# EAGLE design eightbyeight-testcard (EAGLE 7.5.0)

## Sheet 1 of 2
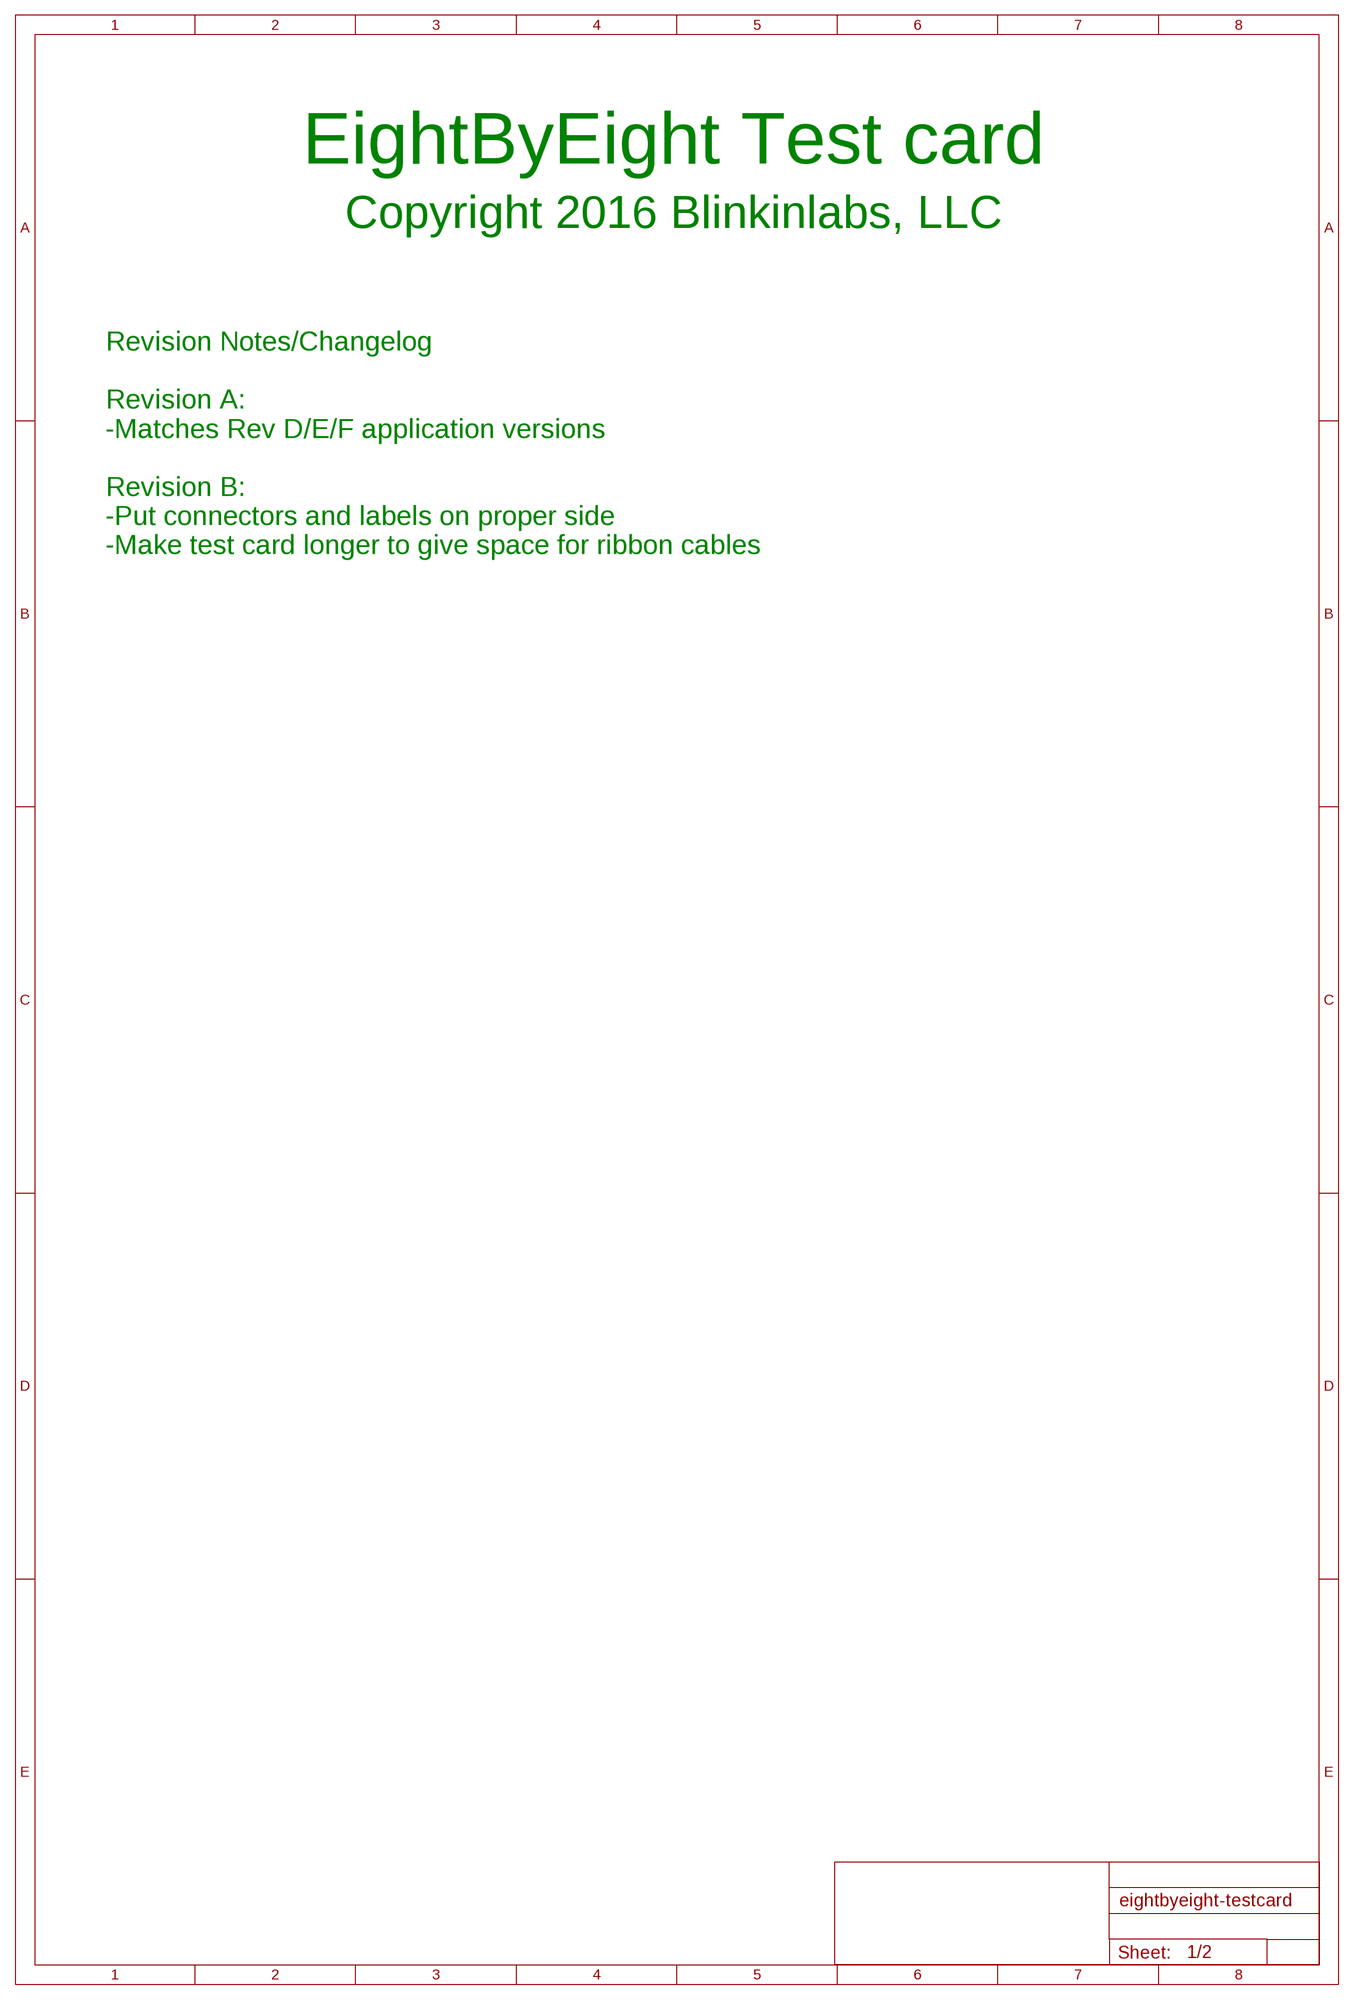
[diagram p0: schematic, sheet 1]

### Notes on the sheet
- EightByEight Test card
- Copyright 2016 Blinkinlabs, LLC
- Revision Notes/Changelog
  
  Revision A:
  -Matches Rev D/E/F application versions
  
  Revision B:
  -Put connectors and labels on proper side
  -Make test card longer to give space for ribbon cables

## Sheet 2 of 2
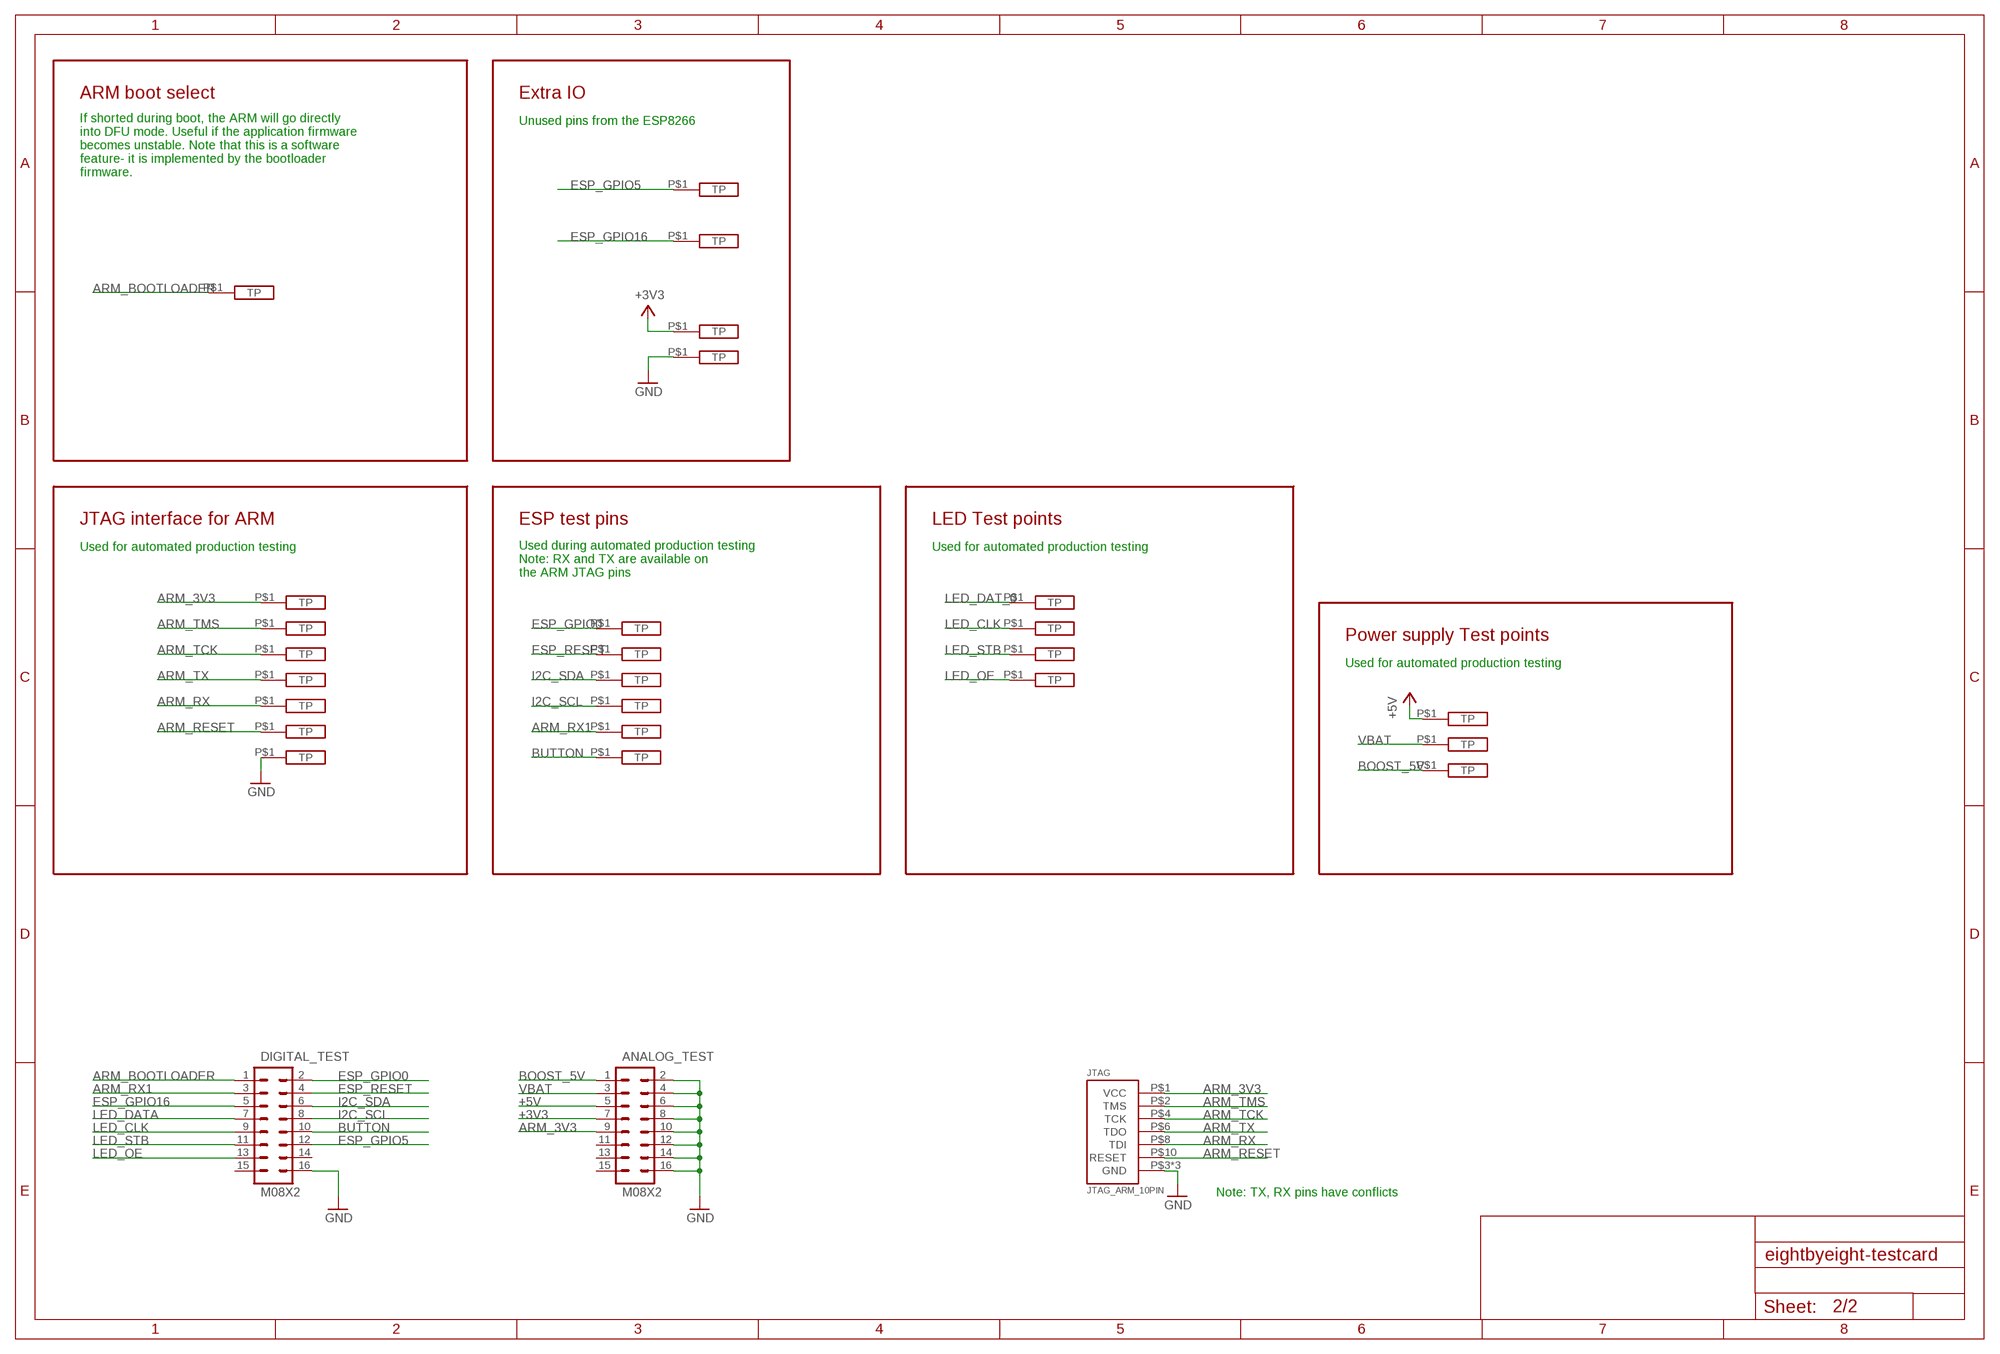
[diagram p1: schematic, sheet 2]

### Parts
5V  TEST_POINT1.4MM  [IO_HOLE_1.4MM]
+3V3  TEST_POINT2.55MM  [IO_HOLE_2.55MM]
ANALOG_TEST  M08X2  [2X8]
ARM_3V3  TEST_POINT1.4MM  [IO_HOLE_1.4MM]
ARM_BOOT  TEST_POINT1.4MM  [IO_HOLE_1.4MM]
ARM_RESET  TEST_POINT1.4MM  [IO_HOLE_1.4MM]
ARM_RX  TEST_POINT1.4MM  [IO_HOLE_1.4MM]
ARM_RX1  TEST_POINT1.4MM  [IO_HOLE_1.4MM]
ARM_TCK  TEST_POINT1.4MM  [IO_HOLE_1.4MM]
ARM_TMS  TEST_POINT1.4MM  [IO_HOLE_1.4MM]
ARM_TX  TEST_POINT1.4MM  [IO_HOLE_1.4MM]
BOOST_5V  TEST_POINT1.4MM  [IO_HOLE_1.4MM]
BUTTON  TEST_POINT1.4MM  [IO_HOLE_1.4MM]
DIGITAL_TEST  M08X2  [2X8]
ESP_GPIO0  TEST_POINT1.4MM  [IO_HOLE_1.4MM]
ESP_GPIO5  TEST_POINT2.55MM  [IO_HOLE_2.55MM]
ESP_GPIO16  TEST_POINT2.55MM  [IO_HOLE_2.55MM]
ESP_RESET  TEST_POINT1.4MM  [IO_HOLE_1.4MM]
GND  TEST_POINT2.55MM  [IO_HOLE_2.55MM]
GND_  TEST_POINT1.4MM  [IO_HOLE_1.4MM]
I2C_SCL  TEST_POINT1.4MM  [IO_HOLE_1.4MM]
I2C_SDA  TEST_POINT1.4MM  [IO_HOLE_1.4MM]
JTAG  JTAG_ARM_10PIN  [2X05-1.27MM-SMD]
LED_CLK  TEST_POINT1.4MM  [IO_HOLE_1.4MM]
LED_DATA  TEST_POINT1.4MM  [IO_HOLE_1.4MM]
LED_OE  TEST_POINT1.4MM  [IO_HOLE_1.4MM]
LED_STB  TEST_POINT1.4MM  [IO_HOLE_1.4MM]
VBAT  TEST_POINT1.4MM  [IO_HOLE_1.4MM]

### Nets
+3V3: +3V3.P$1(TP) ANALOG_TEST.7
+5V: 5V.P$1(TP) ANALOG_TEST.5
ARM_3V3: ANALOG_TEST.9 ARM_3V3.P$1(TP) JTAG.P$1(VCC)
ARM_BOOTLOADER: ARM_BOOT.P$1(TP) DIGITAL_TEST.1
ARM_RESET: ARM_RESET.P$1(TP) JTAG.P$10(RESET)
ARM_RX: ARM_RX.P$1(TP) JTAG.P$8(TDI)
ARM_RX1: ARM_RX1.P$1(TP) DIGITAL_TEST.3
ARM_TCK: ARM_TCK.P$1(TP) JTAG.P$4(TCK)
ARM_TMS: ARM_TMS.P$1(TP) JTAG.P$2(TMS)
ARM_TX: ARM_TX.P$1(TP) JTAG.P$6(TDO)
BOOST_5V: ANALOG_TEST.1 BOOST_5V.P$1(TP)
BUTTON: BUTTON.P$1(TP) DIGITAL_TEST.10
ESP_GPIO0: DIGITAL_TEST.2 ESP_GPIO0.P$1(TP)
ESP_GPIO5: DIGITAL_TEST.12 ESP_GPIO5.P$1(TP)
ESP_GPIO16: DIGITAL_TEST.5 ESP_GPIO16.P$1(TP)
ESP_RESET: DIGITAL_TEST.4 ESP_RESET.P$1(TP)
GND: ANALOG_TEST.2 ANALOG_TEST.4 ANALOG_TEST.6 ANALOG_TEST.8 ANALOG_TEST.10 ANALOG_TEST.12 ANALOG_TEST.14 ANALOG_TEST.16 DIGITAL_TEST.16 GND.P$1(TP) GND_.P$1(TP) JTAG.P$3(GND) JTAG.P$5(GND) JTAG.P$9(GND)
I2C_SCL: DIGITAL_TEST.8 I2C_SCL.P$1(TP)
I2C_SDA: DIGITAL_TEST.6 I2C_SDA.P$1(TP)
LED_CLK: DIGITAL_TEST.9 LED_CLK.P$1(TP)
LED_DAT_0: LED_DATA.P$1(TP)
LED_DATA: DIGITAL_TEST.7
LED_OE: DIGITAL_TEST.13 LED_OE.P$1(TP)
LED_STB: DIGITAL_TEST.11 LED_STB.P$1(TP)
VBAT: ANALOG_TEST.3 VBAT.P$1(TP)
Unconnected: ANALOG_TEST.11 ANALOG_TEST.13 ANALOG_TEST.15 DIGITAL_TEST.14 DIGITAL_TEST.15

### Notes on the sheet
- ARM boot select | Extra IO
- Unused pins from the ESP8266
- If shorted during boot, the ARM will go directly
  into DFU mode. Useful if the application firmware
  becomes unstable. Note that this is a software
  feature- it is implemented by the bootloader
  firmware.
- JTAG interface for ARM | ESP test pins | LED Test points
- Used for automated production testing | Used for automated production testing
- Used during automated production testing
  Note: RX and TX are available on
  the ARM JTAG pins
- Power supply Test points
- Used for automated production testing
- Note: TX, RX pins have conflicts

## Library data of the parts
5V +3V3 ARM_3V3 ARM_BOOT ARM_RESET ARM_RX ARM_RX1 ARM_TCK ARM_TMS ARM_TX BOOST_5V BUTTON ESP_GPIO0 ESP_GPIO5 ESP_GPIO16 ESP_RESET GND GND_ I2C_SCL I2C_SDA LED_CLK LED_DATA LED_OE LED_STB VBAT = DevicesToMerge:TEST_POINT
ANALOG_TEST DIGITAL_TEST = SparkFun-Connectors:M08X2: .1" headers, two rows of 8 each
JTAG = blinkinlabs:JTAG_ARM_10PIN

## Net classes
0 default: width 0.406 mm, drill 0.35 mm
1 power: width 0.406 mm, drill 0.35 mm

## Board
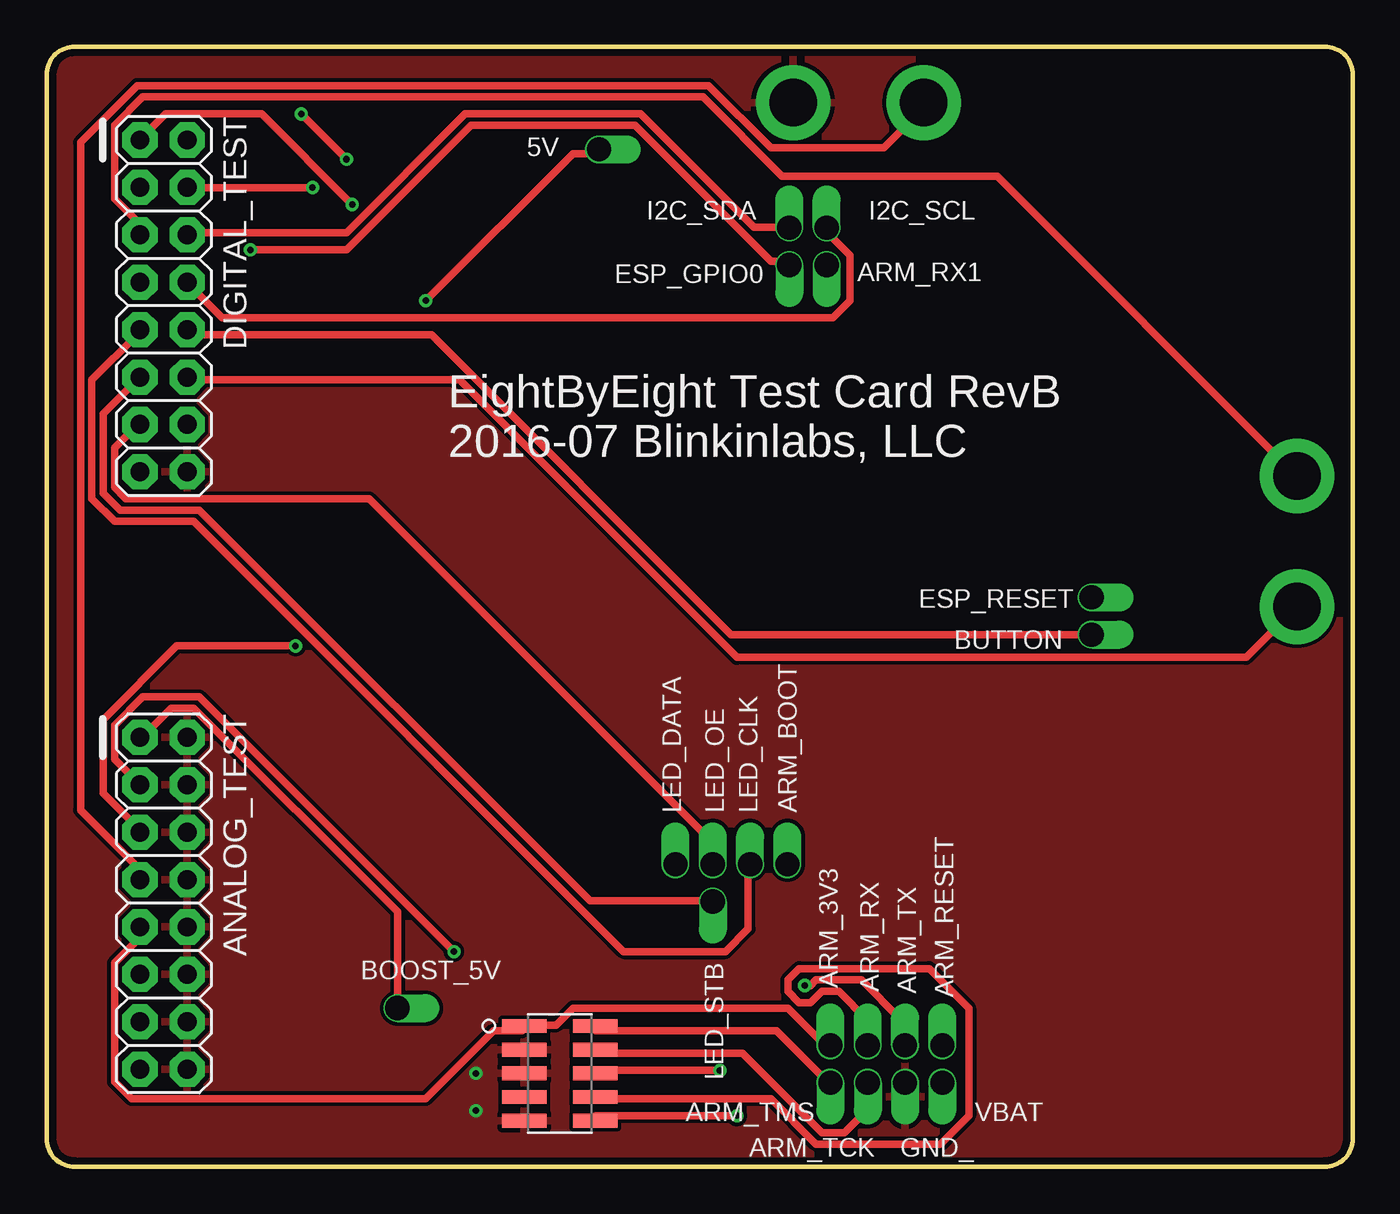
[diagram p2: board, top side]
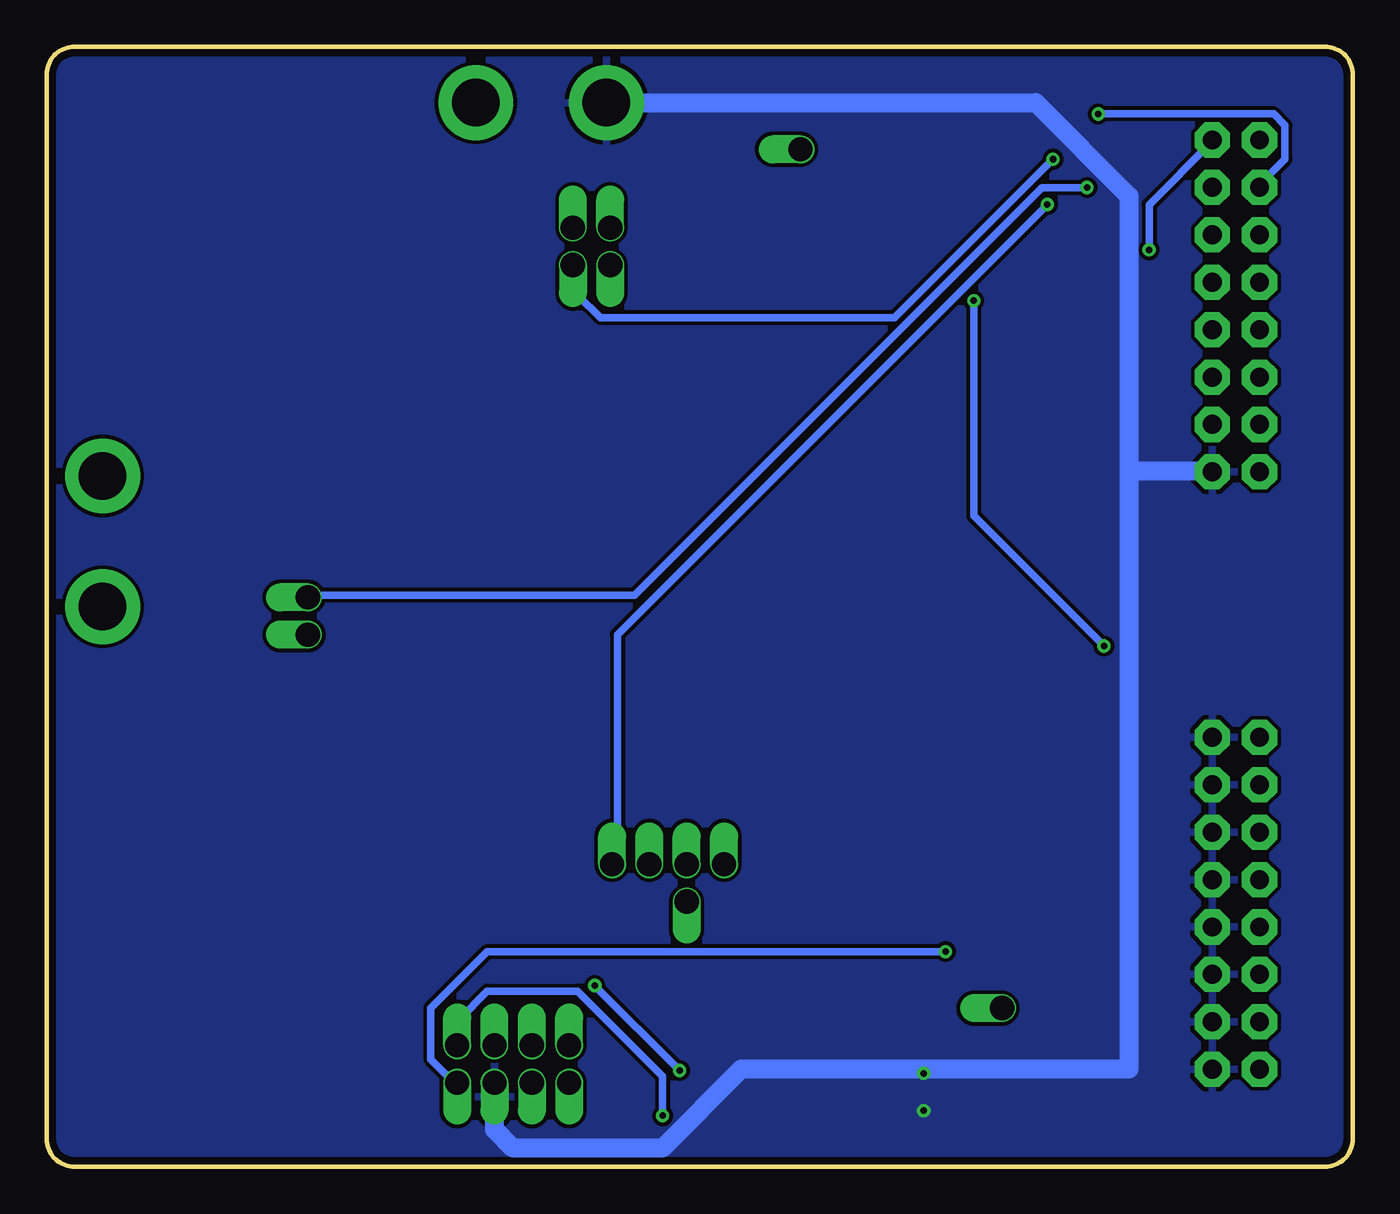
[diagram p3: board, bottom side, seen from below]

Size 70 x 60 mm. Coordinates in mm from the lower left corner, seen from the top.
Outline: 0,58.5 0,1.5 arc90 1.5,0 68.5,0 arc90 70,1.5 70,58.5 arc90 68.5,60 1.5,60 arc90 0,58.5
Copper layers (1*16): Top 0.0356mm / dielectric 0.6mm / Bottom 0.0356mm
Design rules "BlinkyTape *": minimum track width 0.25mm, minimum drill 0.3mm, track to track 0.2mm, track to pad 0.2mm, pad to pad 0.2mm, via to via 0.2mm, smd to smd 0.2mm, copper to edge 15mil, drill to drill 0.25mm, minimum pad ring 3mil, minimum via ring 7mil, stop-mask expansion 2mil, vias tented up to drill 0.35mm, thermal gap 10mil

### Footprints (pad centres in the part's own frame; a part is rotated, then mirrored left to right if it is on the bottom)
IO_HOLE_1.4MM = drill 1.3 pad 1.5 offset: P$1 0,0
IO_HOLE_2.55MM = drill 2.55 pad 4: P$1 0,0
2X8 = drill 1.016 pad 1.88 octagon: 1 0,0; 2 0,2.54; 3 2.54,0; 4 2.54,2.54; 5 5.08,0; 6 5.08,2.54; 7 7.62,0; 8 7.62,2.54; 9 10.16,0; 10 10.16,2.54; 11 12.7,0; 12 12.7,2.54; 13 15.24,0; 14 15.24,2.54; 15 17.78,0; 16 17.78,2.54
2X05-1.27MM-SMD = smd 0.74 x 2.4: P$1 2.54,1.905; P$2 2.54,-1.905; P$3 1.27,1.905; P$4 1.27,-1.905; P$5 0,1.905; P$6 0,-1.905; P$7 -1.27,1.905; P$8 -1.27,-1.905; P$9 -2.54,1.905; P$10 -2.54,-1.905

### Placement (x,y rotation side)
5V  29.6,54.5 0 top
+3V3  47,57 0 top
ANALOG_TEST  5,23 270 top
ARM_3V3  42,6.5 90 top
ARM_BOOT  39.7,16.2 90 top
ARM_RESET  48,6.5 90 top
ARM_RX  44,6.5 90 top
ARM_RX1  41.8,48.3 270 top
ARM_TCK  44,4.5 270 top
ARM_TMS  42,4.5 270 top
ARM_TX  46,6.5 90 top
BOOST_5V  18.8,8.5 0 top
BUTTON  56,28.5 0 top
DIGITAL_TEST  5,55 270 top
ESP_GPIO0  39.8,48.3 270 top
ESP_GPIO5  67,30 0 top
ESP_GPIO16  67,37 0 top
ESP_RESET  56,30.5 0 top
GND  40,57 0 top
GND_  46,4.5 270 top
I2C_SCL  41.8,50.3 90 top
I2C_SDA  39.8,50.3 90 top
JTAG  27.5,5 90 top
LED_CLK  37.7,16.2 90 top
LED_DATA  33.7,16.2 90 top
LED_OE  35.7,16.2 90 top
LED_STB  35.7,14.2 270 bottom
VBAT  48,4.5 270 top

### Tracks (layer width: path | path; a pad name or v marks a point on that pad's centre or on a via)
+3V3
  Top 0.406: ANALOG_TEST.7 4.85,15.46 4.85,16.07 1.82,19.1 1.82,54.88 4.85,57.91 35.47,57.91 38.81,54.58 44.87,54.58 47,56.7 +3V3.P$1
+5V  (via drill 0.35)
  Top 0.406: v20.31,46.39 28.2,54.27 29.41,54.27 5V.P$1 | v13.34,27.89 6.97,27.89 3.03,23.95 3.03,20.01 4.85,18.19 ANALOG_TEST.5
  Bottom 0.406: v20.31,46.39 20.31,34.87 v13.34,27.89
ARM_3V3
  Top 0.406: ARM_3V3.P$1 41.84,6.37 39.72,8.49 28.2,8.49 27.29,7.58 25.77,7.58 JTAG.P$1 25.47,7.28 23.95,7.28 20.31,3.64 4.55,3.64 3.64,4.55 3.64,10.91 4.85,12.13 4.85,12.73 ANALOG_TEST.9
ARM_BOOTLOADER  (via drill 0.35)
  Top 0.406: v16.37,51.54 11.52,56.4 6.37,56.4 5.15,55.18 DIGITAL_TEST.1
  Bottom 0.406: v16.37,51.54 39.42,28.5 39.42,16.37 ARM_BOOT.P$1
ARM_RESET  (via drill 0.35)
  Top 0.406: v36.99,2.73 29.41,2.73 JTAG.P$10
  Bottom 0.406: v36.99,2.73 36.99,4.85 41.54,9.4 46.39,9.4 47.91,7.88 47.91,6.67 ARM_RESET.P$1
ARM_RX
  Top 0.406: JTAG.P$8 29.41,3.64 38.81,3.64 41.23,1.21 47.91,1.21 49.42,2.73 49.42,8.49 47.3,10.61 40.33,10.61 39.72,10.01 39.72,9.4 40.33,8.79 40.93,8.79 41.54,9.4 42.45,9.4 43.96,7.88 43.96,6.67 ARM_RX.P$1
ARM_RX1  (via drill 0.35)
  Top 0.406: v13.64,56.4 v16.07,53.97
  Bottom 0.406: v16.07,53.97 24.56,45.48 40.33,45.48 41.54,46.69 41.54,48.21 ARM_RX1.P$1 | v13.64,56.4 4.25,56.4 3.64,55.79 3.64,53.97 4.85,52.76 DIGITAL_TEST.3
ARM_TCK
  Top 0.406: JTAG.P$4 29.41,6.06 37.29,6.06 41.54,1.82 42.75,1.82 43.96,3.03 43.96,4.25 ARM_TCK.P$1
ARM_TMS
  Top 0.406: JTAG.P$2 29.41,7.28 39.11,7.28 41.84,4.55 ARM_TMS.P$1
ARM_TX  (via drill 0.35)
  Top 0.406: v36.08,5.15 29.41,5.15 JTAG.P$6 | v40.63,9.7 40.93,9.7 41.23,10.01 43.66,10.01 45.78,7.88 45.78,6.67 ARM_TX.P$1
  Bottom 0.406: v40.63,9.7 v36.08,5.15
BOOST_5V
  Top 0.406: BOOST_5V.P$1 18.8,8.79 18.8,13.64 7.88,24.56 6.67,24.56 5.15,23.04 ANALOG_TEST.1
BUTTON
  Top 0.406: BUTTON.P$1 55.79,28.5 36.69,28.5 20.62,44.57 7.58,44.57 DIGITAL_TEST.10
ESP_GPIO0  (via drill 0.35)
  Top 0.406: v10.91,49.12 16.07,49.12 22.74,55.79 31.53,55.79 38.81,48.51 39.72,48.51 ESP_GPIO0.P$1
  Bottom 0.406: v10.91,49.12 10.91,51.54 7.58,54.88 DIGITAL_TEST.2
ESP_GPIO5
  Top 0.406: DIGITAL_TEST.12 7.58,42.15 22.13,42.15 36.99,27.29 64.28,27.29 66.7,29.71 ESP_GPIO5.P$1
ESP_GPIO16
  Top 0.406: DIGITAL_TEST.5 4.85,50.03 4.85,50.63 3.64,51.85 3.64,55.79 5.15,57.3 35.17,57.3 39.42,53.06 50.94,53.06 66.7,37.29 ESP_GPIO16.P$1
ESP_RESET  (via drill 0.35)
  Top 0.406: v14.25,52.45 7.58,52.45 DIGITAL_TEST.4
  Bottom 0.406: v14.25,52.45 16.68,52.45 38.51,30.62 55.79,30.62 ESP_RESET.P$1
GND  (via drill 0.35)
  Bottom 1.016: GND_.P$1 46,2 45,1 37,1 32.78,5.22 12,5.22 12,37.25 | 12,37.25 12,52 17,57 GND.P$1 | 7.5,37.25 12,37.25
  other vias: 23,3 23,5
  pour Bottom: 0,60 70,60 70,0 0,0
  pour Top: 0,0 70,0 70,60 0,60
I2C_SCL
  Top 0.406: I2C_SCL.P$1 41.84,50.03 43.05,48.81 43.05,46.39 42.15,45.48 9.4,45.48 7.58,47.3 DIGITAL_TEST.8
I2C_SDA
  Top 0.406: I2C_SDA.P$1 39.72,50.33 37.9,50.33 31.84,56.4 22.44,56.4 16.07,50.03 7.58,50.03 DIGITAL_TEST.6
LED_CLK
  Top 0.406: LED_CLK.P$1 37.6,16.07 37.6,12.73 36.38,11.52 30.93,11.52 7.88,34.56 3.64,34.56 2.43,35.78 2.43,42.15 4.85,44.57 DIGITAL_TEST.9
LED_OE
  Top 0.406: LED_OE.P$1 35.47,16.37 35.47,17.59 17.28,35.78 4.25,35.78 3.64,36.38 3.64,38.51 4.85,39.72 DIGITAL_TEST.13
LED_STB
  Top 0.406: LED_STB.P$1 35.47,14.25 29.11,14.25 8.19,35.17 3.94,35.17 3.03,36.08 3.03,40.33 4.85,42.15 DIGITAL_TEST.11
VBAT  (via drill 0.35)
  Top 0.406: v21.83,11.52 8.19,25.17 5.15,25.17 3.64,23.65 3.64,21.83 4.85,20.62 ANALOG_TEST.3
  Bottom 0.406: v21.83,11.52 46.39,11.52 49.42,8.49 49.42,5.76 48.21,4.55 VBAT.P$1

### Text on the board
tNames: EightByEight Test Card RevB / 2016-07 Blinkinlabs, LLC